# EAGLE schematic ATmega324PA (EAGLE 7.5.0)
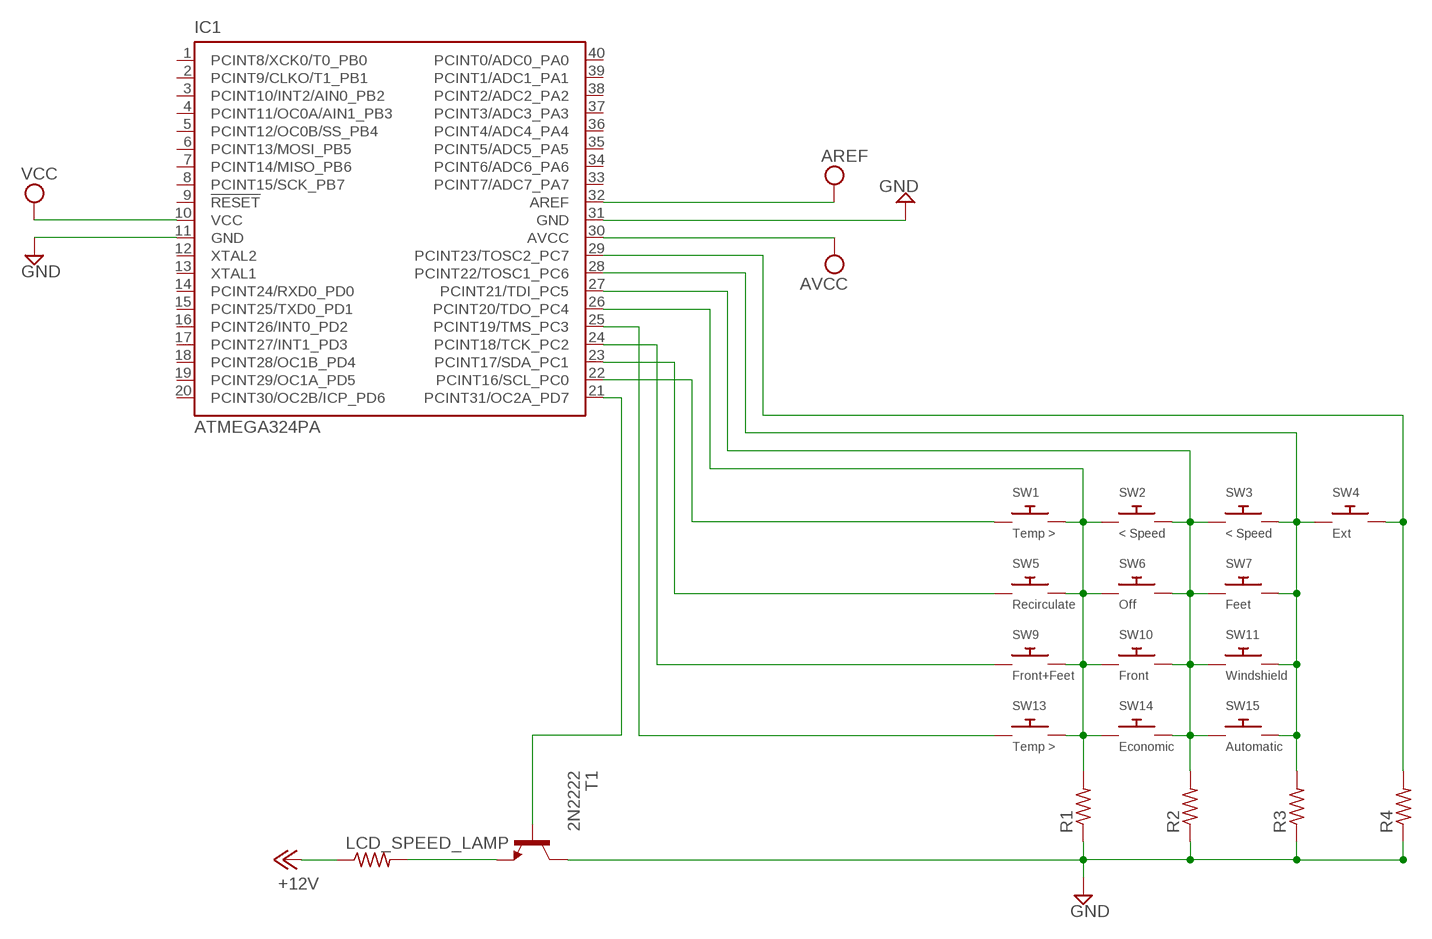
[diagram p0: schematic, sheet 1]

## Parts
IC1  ATMEGA324PA  ATMEGA644-10PU  [DIL40]
LCD_SPEED_LAMP  R-US_0204/7  [0204/7]
R1  R-US_0204/7  [0204/7]
R2  R-US_0204/7  [0204/7]
R3  R-US_0204/7  [0204/7]
R4  R-US_0204/7  [0204/7]
SW1  Temp >  SWITCH_PUSHBUTTONC&K_KSS  [BTN_CK_KSS]
SW2  < Speed  SWITCH_PUSHBUTTONC&K_KSS  [BTN_CK_KSS]
SW3  < Speed  SWITCH_PUSHBUTTONC&K_KSS  [BTN_CK_KSS]
SW4  Ext  SWITCH_PUSHBUTTONC&K_KSS  [BTN_CK_KSS]
SW5  Recirculate  SWITCH_PUSHBUTTONC&K_KSS  [BTN_CK_KSS]
SW6  Off  SWITCH_PUSHBUTTONC&K_KSS  [BTN_CK_KSS]
SW7  Feet  SWITCH_PUSHBUTTONC&K_KSS  [BTN_CK_KSS]
SW9  Front+Feet  SWITCH_PUSHBUTTONC&K_KSS  [BTN_CK_KSS]
SW10  Front  SWITCH_PUSHBUTTONC&K_KSS  [BTN_CK_KSS]
SW11  Windshield  SWITCH_PUSHBUTTONC&K_KSS  [BTN_CK_KSS]
SW13  Temp >  SWITCH_PUSHBUTTONC&K_KSS  [BTN_CK_KSS]
SW14  Economic  SWITCH_PUSHBUTTONC&K_KSS  [BTN_CK_KSS]
SW15  Automatic  SWITCH_PUSHBUTTONC&K_KSS  [BTN_CK_KSS]
T1  2N2222  [TO92-EBC-OVAL]

## Nets
+12V: LCD_SPEED_LAMP.1
GND: IC1.11(GND) IC1.31(GND) R1.1 R2.1 R3.1 R4.1 T1.C
N$1: LCD_SPEED_LAMP.2 T1.E
PC: IC1.29(PCINT23/TOSC2_PC7) R4.2 SW4.P$2
PC0: IC1.22(PCINT16/SCL_PC0) SW1.P$1
PC1: IC1.23(PCINT17/SDA_PC1) SW5.P$1
PC2: IC1.24(PCINT18/TCK_PC2) SW9.P$1
PC3: IC1.25(PCINT19/TMS_PC3) SW13.P$1
PC4: IC1.26(PCINT20/TDO_PC4) R1.2 SW1.P$2 SW2.P$1 SW5.P$2 SW6.P$1 SW9.P$2 SW10.P$1 SW13.P$2 SW14.P$1
PC5: IC1.27(PCINT21/TDI_PC5) R2.2 SW2.P$2 SW3.P$1 SW6.P$2 SW7.P$1 SW10.P$2 SW11.P$1 SW14.P$2 SW15.P$1
PC6: IC1.28(PCINT22/TOSC1_PC6) R3.2 SW3.P$2 SW4.P$1 SW7.P$2 SW11.P$2 SW15.P$2
PD7: IC1.21(PCINT31/OC2A_PD7) T1.B
VCC: IC1.10(VCC) IC1.30(AVCC) IC1.32(AREF) ; supply symbol labelled AREF, AVCC
Unconnected: IC1.1(PCINT8/XCK0/T0_PB0) IC1.2(PCINT9/CLKO/T1_PB1) IC1.3(PCINT10/INT2/AIN0_PB2) IC1.4(PCINT11/OC0A/AIN1_PB3) IC1.5(PCINT12/OC0B/SS_PB4) IC1.6(PCINT13/MOSI_PB5) IC1.7(PCINT14/MISO_PB6) IC1.8(PCINT15/SCK_PB7) IC1.9(!RESET) IC1.12(XTAL2) IC1.13(XTAL1) IC1.14(PCINT24/RXD0_PD0) IC1.15(PCINT25/TXD0_PD1) IC1.16(PCINT26/INT0_PD2) IC1.17(PCINT27/INT1_PD3) IC1.18(PCINT28/OC1B_PD4) IC1.19(PCINT29/OC1A_PD5) IC1.20(PCINT30/OC2B/ICP_PD6) IC1.33(PCINT7/ADC7_PA7) IC1.34(PCINT6/ADC6_PA6) IC1.35(PCINT5/ADC5_PA5) IC1.36(PCINT4/ADC4_PA4) IC1.37(PCINT3/ADC3_PA3) IC1.38(PCINT2/ADC2_PA2) IC1.39(PCINT1/ADC1_PA1) IC1.40(PCINT0/ADC0_PA0)

## Library data of the parts
IC1 = atmel:ATMEGA644-*PU: 8-bit Microcontroller with 64K Bytes In-System Programmable Flash Auto generated by make-symbol-device-package-bsdl.ulp Rev. 34 Source: http://www.atmel.com/dyn/resources/prod_documents/doc2593.pdf; MPN: ATMEGA644V-10PU; OC_FARNELL: 1288342; OC_NEWARK: 23M5062
LCD_SPEED_LAMP R1-R4 = adafruit:R-US_: RESISTOR, American symbol
SW1-SW7 SW9-SW11 SW13-SW15 = adafruit:SWITCH_PUSHBUTTON: Buttons SOFTTOUCHSMD_SJ - Soft touch temporary push button (Super Junk Akihabara) Compatible with SKPMANE010 [Mouser: 688-SKPMAN] C&K_KSS = Digikey: KSS221GLFS
T1 = adafruit:2N2222: NPN TRANSISTOR Big oval pads